# EAGLE design amebot_arduino_leds (EAGLE 6.5.0)
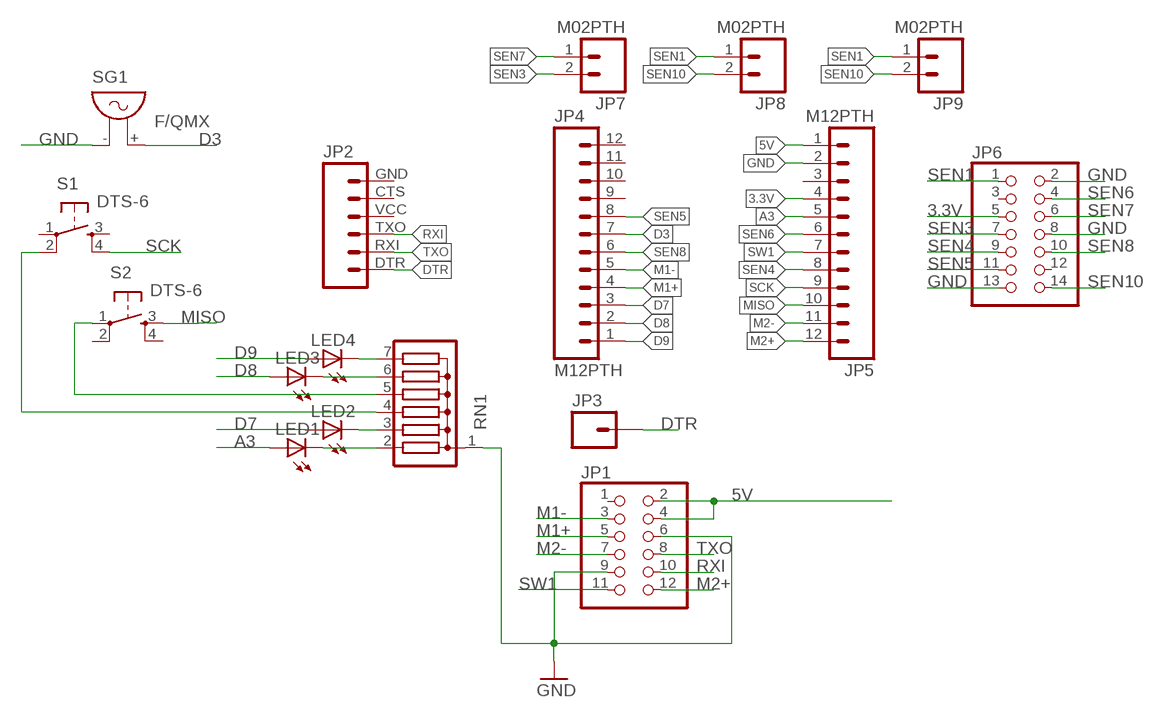
[diagram p0: schematic, sheet 1]

## Parts
JP1  PINHD-2X6  [2X06]
JP2  M06SIP  [1X06]
JP3  M01PTH_LONGPAD  [1X01_LONGPAD]
JP4  M12PTH  [1X12]
JP5  M12PTH  [1X12]
JP6  PINHD-2X7  [2X07]
JP7  M02PTH  [1X02]
JP8  M02PTH  [1X02]
JP9  M02PTH  [1X02]
LED1  LED3MM  [LED3MM]
LED2  LED3MM  [LED3MM]
LED3  LED3MM  [LED3MM]
LED4  LED3MM  [LED3MM]
RN1  G06R  [SIL7]
S1  DTS-6  [DTS-6]
S2  DTS-6  [DTS-6]
SG1  F/QMX  [F/QMX]

## Nets
3.3V: JP5.4 JP6.5
5V: JP1.2 JP1.4 JP5.1
A3: JP5.5 LED1.A
D3: JP4.7 SG1.+
D7: JP4.3 LED2.A
D8: JP4.2 LED3.A
D9: JP4.1 LED4.A
DTR: JP2.DTR JP3.1
GND: JP1.6 JP1.9 JP5.2 JP6.2 JP6.8 JP6.13 RN1.1 SG1.-
M1+: JP1.5 JP4.4
M1-: JP1.3 JP4.5
M2+: JP1.12 JP5.12
M2-: JP1.7 JP5.11
MISO: JP5.10 S2.3
N$1: LED2.K(C) RN1.3
N$2: LED1.K(C) RN1.2
N$3: LED4.K(C) RN1.7
N$4: LED3.K(C) RN1.6
N$7: RN1.4 S1.2
N$9: RN1.5 S2.1
RXI: JP1.10 JP2.TXO
SCK: JP5.9 S1.4
SEN1: JP6.1 JP8.1 JP9.1
SEN3: JP6.7 JP7.2
SEN4: JP5.8 JP6.9
SEN5: JP4.8 JP6.11
SEN6: JP5.6 JP6.4
SEN7: JP6.6 JP7.1
SEN8: JP4.6 JP6.10
SEN10: JP6.14 JP8.2 JP9.2
SW1: JP1.11 JP5.7
TXO: JP1.8 JP2.RXI
Unconnected: JP1.1 JP2.CTS JP2.GND JP2.VCC JP4.9 JP4.10 JP4.11 JP4.12 JP5.3 JP6.3 JP6.12 S1.1 S1.3 S2.2 S2.4

## Library data of the parts
JP1 = pinhead:PINHD-2X6: PIN HEADER
JP2 = SparkFun-Connectors:M06: Header 6 Standard 6-pin 0.1" header. Use with straight break away headers (SKU : PRT-00116), right angle break away headers (PRT-00553), swiss pins (PRT-00743), machine pins (PRT-00117), and female headers (PRT-00115). Molex polarized connector foot print use with SKU : PRT-08094 with associated crimp pins and housings. NOTES ON THE VARIANTS LOCK and LOCK_LONGPADS... This footprint was designed to help hold the alignment of a through-hole component (i.e. 6-pin header) while soldering it into place. You may notice that each hole has been shifted either up or down by 0.005 of an inch from it's more standard position (which is a perfectly straight line). This slight alteration caused the pins (the squares in the middle) to touch the edges of the holes. Because they are alternating, it causes a "brace" to hold the component in place. 0.005 has proven to be the perfect amount of "off-center" position when using our standard breakaway headers. Although looks a little odd when you look at the bare footprint, once you have a header in there, the alteration is very hard to notice. Also,if you push a header all the way into place, it is covered up entirely on the bottom side. This idea of altering the position of holes to aid alignment will be further integrated into the Sparkfun Library for other footprints. It can help hold any component with 3 or more connection pins.
JP3 = SparkFun-Connectors:M01: Header 1 Standard 1-pin 0.1" header. Use with straight break away headers (SKU : PRT-00116), right angle break away headers (PRT-00553), swiss pins (PRT-00743), machine pins (PRT-00117), and female headers (PRT-00115).
JP4 JP5 = SparkFun-Connectors:M12: Header 12 Standard 12-pin 0.1" header. Use with straight break away headers (SKU : PRT-00116), right angle break away headers (PRT-00553), swiss pins (PRT-00743), machine pins (PRT-00117), and female headers (PRT-00115).
JP6 = pinhead:PINHD-2X7: PIN HEADER
JP7-JP9 = SparkFun-Connectors:M02: Standard 2-pin 0.1" header. Use with - straight break away headers ( PRT-00116) - right angle break away headers (PRT-00553) - swiss pins (PRT-00743) - machine pins (PRT-00117) - female headers (PRT-00115) Molex polarized connector foot print use with: PRT-08233 with associated crimp pins and housings. 2.54_SCREWTERM for use with PRT-10571. 3.5mm Screw Terminal footprints for PRT-08084 5mm Screw Terminal footprints for use with PRT-08432
LED1-LED4 = led:LED: LED OSRAM: - CHIPLED LG R971, LG N971, LY N971, LG Q971, LY Q971, LO R971, LY R971 LH N974, LH R974 LS Q976, LO Q976, LY Q976 LO Q996 - Hyper CHIPLED LW Q18S LB Q993, LB Q99A, LB R99A - SideLED LS A670, LO A670, LY A670, LG A670, LP A670 LB A673, LV A673, LT A673, LW A673 LH A674 LY A675 LS A676, LA A676, LO A676, LY A676, LW A676 LS A679, LY A679, LG A679 - Hyper Micro SIDELED® LS Y876, LA Y876, LO Y876, LY Y876 LT Y87S - SmartLED LW L88C, LW L88S LB L89C, LB L89S, LG L890 LS L89K, LO L89K, LY L89K LS L896, LA L896, LO L896, LY L896 - TOPLED LS T670, LO T670, LY T670, LG T670, LP T670 LSG T670, LSP T670, LSY T670, LOP T670, LYG T670 LG T671, LOG T671, LSG T671 LB T673, LV T673, LT T673, LW T673 LH T674 LS T676, LA T676, LO T676, LY T676, LB T676, LH T676, LSB T676, LW T676 LB T67C, LV T67C, LT T67C, LS T67K, LO T67K, LY T67K, LW E67C LS E67B, LA E67B, LO E67B, LY E67B, LB E67C, LV E67C, LT E67C LW T67C LS T679, LY T679, LG T679 LS T770, LO T770, LY T770, LG T770, LP T770 LB T773, LV T773, LT T773, LW T773 LH T774 LS E675, LA E675, LY E675, LS T675 LS T776, LA T776, LO T776, LY T776, LB T776 LHGB T686 LT T68C, LB T68C - Hyper Mini TOPLED® LB M676 - Mini TOPLED Santana® LG M470 LS M47K, LO M47K, LY M47K Source: http://www.osram.convergy.de LUXEON: - LUMILED® LXK2-PW12-R00, LXK2-PW12-S00, LXK2-PW14-U00, LXK2-PW14-V00 LXK2-PM12-R00, LXK2-PM12-S00, LXK2-PM14-U00 LXK2-PE12-Q00, LXK2-PE12-R00, LXK2-PE12-S00, LXK2-PE14-T00, LXK2-PE14-U00 LXK2-PB12-K00, LXK2-PB12-L00, LXK2-PB12-M00, LXK2-PB14-N00, LXK2-PB14-P00, LXK2-PB14-Q00 LXK2-PR12-L00, LXK2-PR12-M00, LXK2-PR14-Q00, LXK2-PR14-R00 LXK2-PD12-Q00, LXK2-PD12-R00, LXK2-PD12-S00 LXK2-PH12-R00, LXK2-PH12-S00 LXK2-PL12-P00, LXK2-PL12-Q00, LXK2-PL12-R00 Source: www.luxeon.com KINGBRIGHT: KA-3528ASYC Source: www.kingbright.com
RN1 = resistor-sil:G06R: SIL RESISTOR; OC_FARNELL: unknown; OC_NEWARK: unknown
S1 S2 = switch-tact:DTS-6
SG1 = buzzer:F/QMX: BUZZER Source: Buerklin; OC_FARNELL: unknown; OC_NEWARK: unknown

## Net classes
1 vcc: width 0.254 mm

## Board
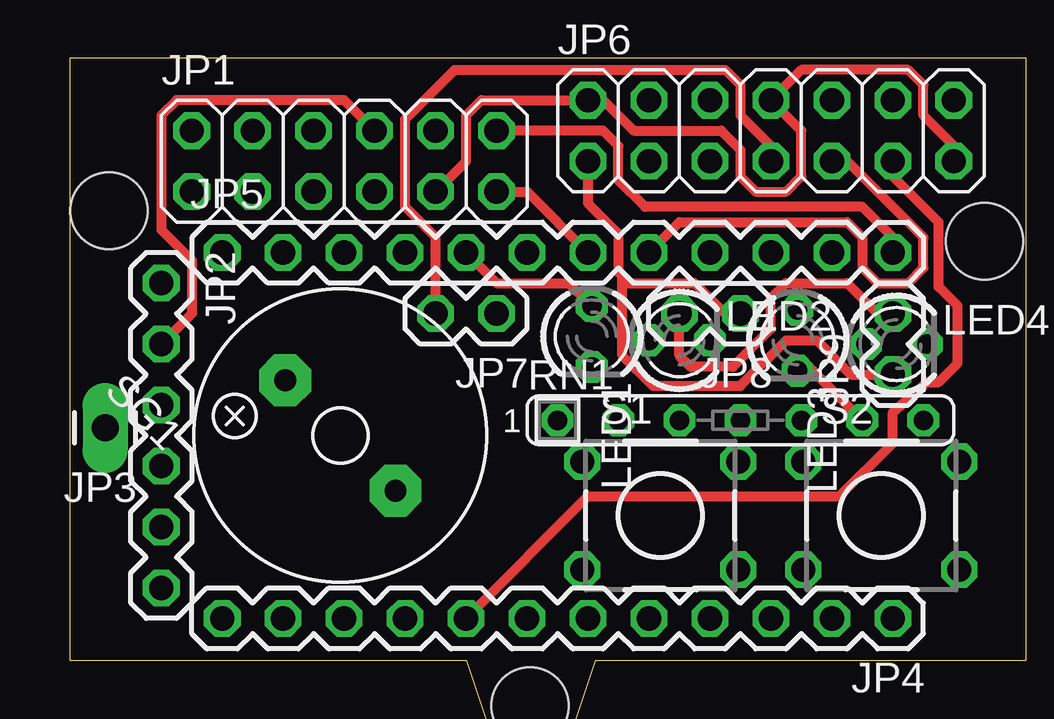
[diagram p1: board, top side]
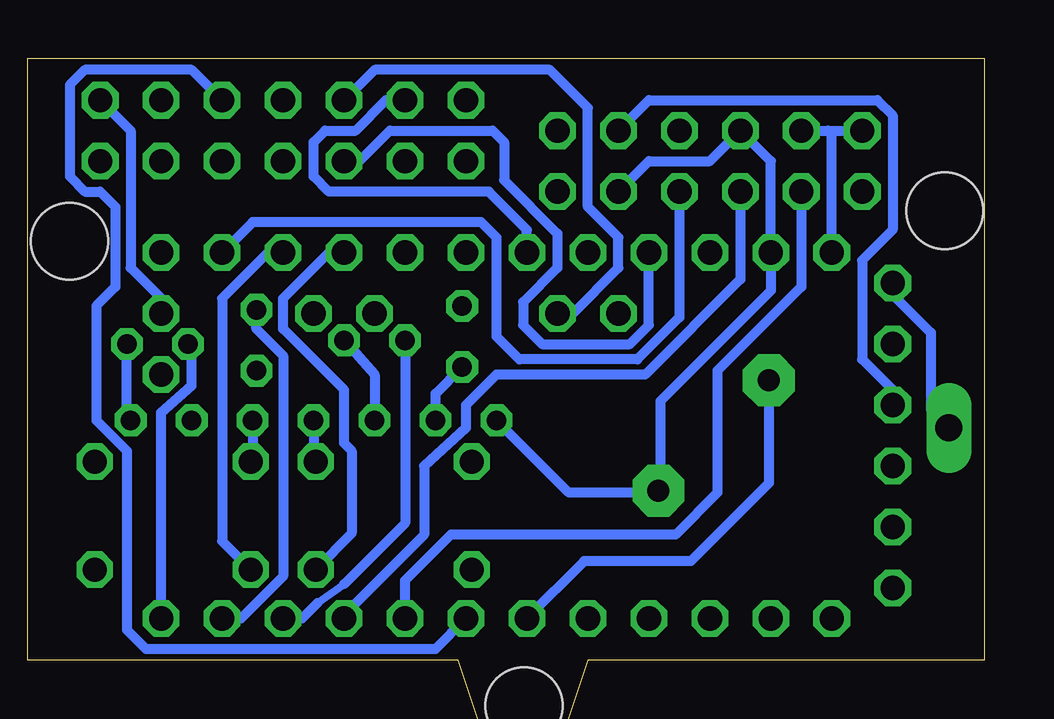
[diagram p2: board, bottom side, seen from below]

No outline drawn. Coordinates in mm, seen from the top.
Copper layers (1*16): Top 0.035mm / dielectric 1.5mm / Bottom 0.035mm
Design rules "default": minimum track width 10mil, minimum drill 24mil, track to track 8mil, track to pad 8mil, pad to pad 8mil, via to via 8mil, smd to smd 8mil, copper to edge 40mil, drill to drill 8mil, minimum pad ring 10mil, minimum via ring 8mil, stop-mask expansion 4mil, vias tented up to drill 0mil, thermal gap 10mil
Holes 3.2 mm at 1.64,18.73 38.11,17.45 19.18,-1.9
Milling: 8 lines

### Footprints (pad centres in the part's own frame; a part is rotated, then mirrored left to right if it is on the bottom)
2X06 = drill 1.016 octagon: 1 -6.35,-1.27; 2 -6.35,1.27; 3 -3.81,-1.27; 4 -3.81,1.27; 5 -1.27,-1.27; 6 -1.27,1.27; 7 1.27,-1.27; 8 1.27,1.27; 9 3.81,-1.27; 10 3.81,1.27; 11 6.35,-1.27; 12 6.35,1.27
1X06 = drill 1.016 octagon: CTS 10.16,0; DTR 0,0; GND 12.7,0; RXI 2.54,0; TXO 5.08,0; VCC 7.62,0
1X01_LONGPAD = drill 1.118 pad 1.88 long: 1 0,0
1X12 = drill 1.016 octagon: 1 0,0; 2 2.54,0; 3 5.08,0; 4 7.62,0; 5 10.16,0; 6 12.7,0; 7 15.24,0; 8 17.78,0; 9 20.32,0; 10 22.86,0; 11 25.4,0; 12 27.94,0
2X07 = drill 1.016 octagon: 1 -7.62,-1.27; 2 -7.62,1.27; 3 -5.08,-1.27; 4 -5.08,1.27; 5 -2.54,-1.27; 6 -2.54,1.27; 7 0,-1.27; 8 0,1.27; 9 2.54,-1.27; 10 2.54,1.27; 11 5.08,-1.27; 12 5.08,1.27; 13 7.62,-1.27; 14 7.62,1.27
1X02 = drill 1.016 octagon: 1 0,0; 2 2.54,0
LED3MM = drill 0.813 octagon: A -1.27,0; K 1.27,0
SIL7 = drill 0.813 octagon: 1 -7.62,0; 2 -5.08,0; 3 -2.54,0; 4 0,0; 5 2.54,0; 6 5.08,0; 7 7.62,0
DTS-6 = drill 1 octagon: 1 -3.25,2.25; 2 3.25,2.25; 3 -3.25,-2.25; 4 3.25,-2.25
F/QMX = drill 0.914 pad 2.159 octagon: + 3.251,0; - -3.251,0

### Placement (x,y rotation side)
JP1  11.43,20.8 0 top
JP2  3.81,15.72 270 top
JP3  1.47,9.68 180 top
JP4  34.29,1.75 180 top
JP5  6.35,16.99 0 top
JP6  29.21,22.07 0 top
JP7  17.78,14.45 180 top
JP8  27.94,14.45 180 top
JP9  34.29,11.91 90 top
LED1  21.75,13.49 270 top
LED2  25.4,13.34 0 top
LED3  30.32,13.34 270 top
LED4  34.45,13.18 0 top
RN1  27.94,10 0 top
S1  24.61,6.03 0 top
S2  33.81,6.03 0 top
SG1  11.27,9.37 135 top

### Tracks (layer width: path | path; a pad name or v marks a point on that pad's centre or on a via)
3.3V
  Bottom 0.406: JP6.5 26.04,20.8 24.77,22.07 20.48,22.07 20,21.59 20,20 17.78,17.78 17.78,16.35 19.21,14.92 19.21,13.97 18.41,13.18 14.76,13.18 13.97,13.97 JP5.4
5V
  Bottom 0.406: JP1.4 6.51,22.07 | 6.51,22.07 JP1.2 | JP5.1 6.35,21.91 6.51,22.07
A3
  Top 0.406: JP5.5 17.78,15.72 20.8,15.72 LED1.A
D3
  Bottom 0.406: SG1.+ 8.97,7.38 12.22,4.13 16.67,4.13 JP4.7
D7
  Bottom 0.305: 26.67,3.17 27.78,2.38
  Bottom 0.406: LED2.A 24.13,5.71 26.67,3.17 | 27.78,2.38 28.42,1.75 JP4.3
D8
  Bottom 0.406: JP4.2 30.96,1.75 29.21,3.49 29.21,12.7 30.32,13.81 LED3.A
D9
  Bottom 0.406: JP4.1 34.29,10.32 33.02,11.43 33.02,13.02 LED4.A
DTR
  Bottom 0.406: JP2.DTR 3.81,15.24 2.22,13.65 2.22,10.44 JP3.1
GND
  Top 0.406: JP1.9 16.51,20.8 16.51,22.7 17.14,23.34 JP6.2 22.23,23.34 23.5,22.07 27.15,22.07 27.94,21.27 27.94,20.16 28.57,19.53 29.84,19.53 30.48,20.16 30.48,22.07 JP6.8 30.48,24.61 34.92,24.61 35.56,23.97 35.56,22.7 36.83,21.43 JP6.13
  Bottom 0.406: JP1.9 13.97,20.8 11.43,20.8 JP1.6 8.89,20.8 JP5.2 8.89,15.4 13.49,10.79 13.49,7.14 SG1.- 13.65,6.99 17.3,6.99 RN1.1
M1+
  Bottom 0.406: JP1.5 10.16,15.88 14.13,11.91 20.32,11.91 21.59,10.64 21.59,9.68 23.34,8.1 23.34,5.24 26.67,1.91 JP4.4
M1-
  Bottom 0.406: JP1.3 7.62,15.56 11.11,12.06 11.11,6.99 12.86,5.24 22.23,5.24 24.13,3.33 JP4.5
M2+
  Top 0.406: JP5.12 34.29,17.62 33.02,18.89 23.97,18.89 22.86,20 22.86,21.43 22.23,22.07 JP1.12
M2-
  Bottom 0.406: JP1.7 12.7,14.29 14.45,12.54 19.37,12.54 20.32,13.49 20.32,17.62 20.95,18.26 30.48,18.26 JP5.11
MISO
  Bottom 0.406: S2.3 31.75,4.97 31.75,15.08 29.84,16.99 JP5.10
N$1
  Bottom 0.406: RN1.3 25.4,11.91 LED2.K
N$2
  Bottom 0.406: RN1.2 22.86,11.11 LED1.K
N$3
  Bottom 0.406: RN1.7 35.72,10.16 LED4.K
N$4
  Top 0.406: RN1.6 30.96,12.06 LED3.K
N$7
  Bottom 0.406: RN1.4 27.94,8.37 S1.2
N$9
  Bottom 0.406: RN1.5 30.48,8.37 S2.1
RXI
  Bottom 0.406: JP1.10 13.97,23.34 4.45,23.34 3.81,22.7 3.81,17.94 5.08,16.67 5.08,12.54 3.81,11.27 JP2.TXO
SCK
  Bottom 0.406: S1.4 26.35,5.29 26.35,8.73 26.67,9.05 26.67,11.27 29.21,13.81 29.21,15.08 27.3,16.99 JP5.9
SEN1
  Top 0.406: JP8.1 27.3,14.45 26.04,15.72 23.02,15.72 | JP9.1 32.54,11.91 31.11,13.34 29.84,13.34 27.94,11.43 24.29,11.43 23.02,12.7 23.02,15.72 | JP6.1 21.59,19.05 22.86,17.78 22.86,16.19 23.02,16.03 23.02,15.72
SEN3
  Top 0.406: JP7.2 15.24,17.62 13.97,18.89 13.97,22.54 16.03,24.61 27.3,24.61 27.94,23.97 27.94,22.7 29.21,21.43 JP6.7
SEN4
  Top 0.406: JP5.8 25.4,18.26 32.38,18.26 33.02,17.62 33.02,16.35 33.66,15.72 34.92,15.72 35.56,16.35 35.56,17.62 32.38,20.8 JP6.9
SEN5
  Top 0.406: JP4.8 21.59,6.83 32.07,6.83 34.29,9.05 34.29,10.32 35.72,11.59 36.2,11.59 36.99,12.38 36.99,14.76 36.2,15.56 36.2,18.26 34.29,20.16 JP6.11
SEN6
  Bottom 0.406: JP5.6 19.05,17.94 20.64,19.53 27.3,19.53 27.94,20.16 27.94,21.59 27.46,22.07 26.19,22.07 24.92,23.34 JP6.4
SEN7
  Bottom 0.406: JP7.1 17.14,14.45 15.24,16.35 15.24,17.62 16.51,18.89 16.51,23.02 18.1,24.61 25.4,24.61 JP6.6
SEN8
  Bottom 0.406: JP6.10 33.02,24.61 37.47,24.61 38.1,23.97 38.1,20.16 37.47,19.53 36.83,19.53 36.2,18.89 36.2,15.56 36.99,14.76 36.99,10 35.72,8.73 35.72,1.27 34.92,0.48 22.86,0.48 JP4.6
SEN10
  Top 0.406: JP8.2 25.4,12.7 25.88,12.22 27.62,12.22 29.21,13.81 29.21,15.08 29.84,15.72 32.38,15.72 33.66,14.45 JP9.2
  Bottom 0.406: JP6.14 35.56,22.07 35.56,16.35 34.29,15.08 JP9.2
SW1
  Top 0.406: JP1.11 19.05,19.53 JP5.7
TXO
  Top 0.406: JP1.8 11.43,23.34 4.45,23.34 3.81,22.7 3.81,17.94 5.08,16.67 5.08,14.45 JP2.RXI